# EAGLE design ZeroUNOBridge (EAGLE 6.6.0)
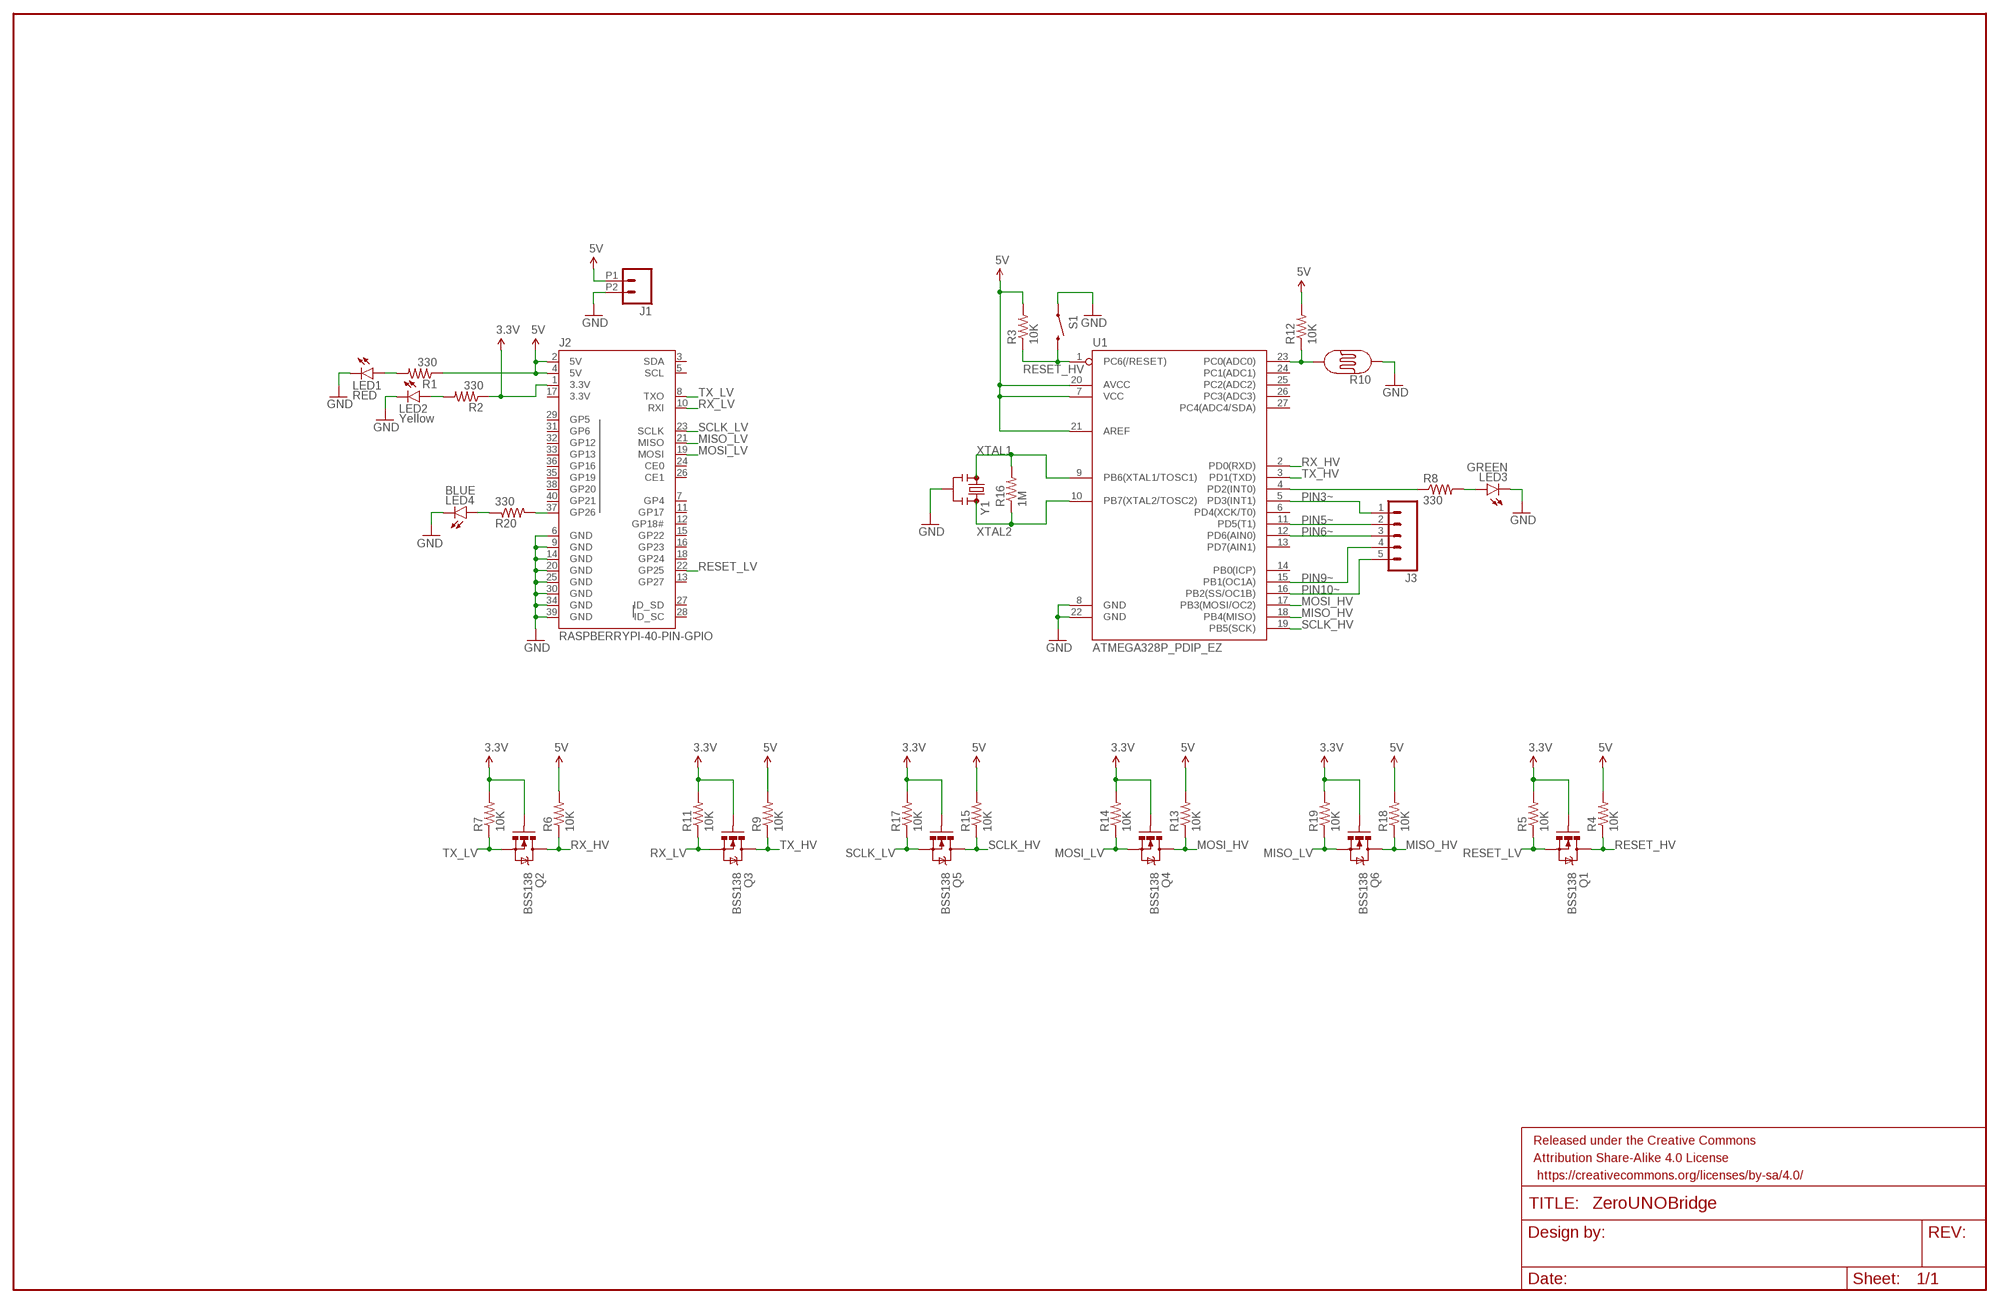
[diagram p0: schematic, sheet 1]

## Parts
FRAME1  FRAME-LEDGER  [CREATIVE_COMMONS]
J1  M022.54MM_SCREWTERM  [1X02_2.54_SCREWTERM]
J2  RASPBERRYPI-40-PIN-GPIO  [2X20-SHROUDED]
J3  M05SCREW  [SCREWTERMINAL-3.5MM-5]
LED1  RED  LED-RED0603  [LED-0603]
LED2  Yellow  LED-YELLOW0603  [LED-0603]
LED3  GREEN  LED-GREEN0603  [LED-0603]
LED4  BLUE  LED-BLUE0603  [LED-0603]
Q1  BSS138  MOSFET-NCHANNELBSS138  [SOT23-3]
Q2  BSS138  MOSFET-NCHANNELBSS138  [SOT23-3]
Q3  BSS138  MOSFET-NCHANNELBSS138  [SOT23-3]
Q4  BSS138  MOSFET-NCHANNELBSS138  [SOT23-3]
Q5  BSS138  MOSFET-NCHANNELBSS138  [SOT23-3]
Q6  BSS138  MOSFET-NCHANNELBSS138  [SOT23-3]
R1  330  330OHM1/10W1%(0603)  [0603-RES]
R2  330  330OHM1/10W1%(0603)  [0603-RES]
R3  10K  10KOHM-1/10W-1%(0603)0603  [0603-RES]
R4  10K  10KOHM-1/10W-1%(0603)0603  [0603-RES]
R5  10K  10KOHM-1/10W-1%(0603)0603  [0603-RES]
R6  10K  10KOHM-1/10W-1%(0603)0603  [0603-RES]
R7  10K  10KOHM-1/10W-1%(0603)0603  [0603-RES]
R8  330  330OHM1/10W1%(0603)  [0603-RES]
R9  10K  10KOHM-1/10W-1%(0603)0603  [0603-RES]
R10  PHOTOCELLPTH  [PHOTOCELL]
R11  10K  10KOHM-1/10W-1%(0603)0603  [0603-RES]
R12  10K  10KOHM-1/10W-1%(0603)0603  [0603-RES]
R13  10K  10KOHM-1/10W-1%(0603)0603  [0603-RES]
R14  10K  10KOHM-1/10W-1%(0603)0603  [0603-RES]
R15  10K  10KOHM-1/10W-1%(0603)0603  [0603-RES]
R16  1M  1MOHM-1/10W-1%(0603)  [0603-RES]
R17  10K  10KOHM-1/10W-1%(0603)0603  [0603-RES]
R18  10K  10KOHM-1/10W-1%(0603)0603  [0603-RES]
R19  10K  10KOHM-1/10W-1%(0603)0603  [0603-RES]
R20  330  330OHM1/10W1%(0603)  [0603-RES]
S1  SWITCH-MOMENTARY-2PTH  [TACTILE-PTH]
U1  ATMEGA328P_PDIP_EZ  [DIL28-EZ]
Y1  RESONATORPTH  [RESONATOR-PTH]

## Nets
3.3V: J2.1(3.3V) Q1.1(G) Q2.1(G) Q3.1(G) Q4.1(G) Q5.1(G) Q6.1(G) R2.1 R5.2 R7.2 R11.2 R14.2 R17.2 R19.2
5V: J1.P1 J2.2(5V) J2.4(5V) R1.1 R3.2 R4.2 R6.2 R9.2 R12.2 R13.2 R15.2 R18.2 U1.7(VCC) U1.20(AVCC) U1.21(AREF)
GND: J1.P2 J2.6(GND) J2.9(GND) J2.14(GND) J2.20(GND) J2.25(GND) J2.30(GND) J2.34(GND) J2.39(GND) LED1.C LED2.C LED3.C LED4.C R10.1 S1.1 U1.8(GND) U1.22(GND) Y1.2
MISO_HV: Q6.3(D) R18.1 U1.18(PB4(MISO))
MISO_LV: J2.21(MISO) Q6.2(S) R19.1
MOSI_HV: Q4.3(D) R13.1 U1.17(PB3(MOSI/OC2))
MOSI_LV: J2.19(MOSI) Q4.2(S) R14.1
N$1: J2.37(GP26) R20.2
N$3: LED1.A R1.2
N$4: LED2.A R2.2
N$5: LED4.A R20.1
N$6: R8.1 U1.4(PD2(INT0))
N$7: LED3.A R8.2
N$9: R10.2 R12.1 U1.23(PC0(ADC0))
PIN3~: J3.1 U1.5(PD3(INT1))
PIN5~: J3.2 U1.11(PD5(T1))
PIN6~: J3.3 U1.12(PD6(AIN0))
PIN9~: J3.4 U1.15(PB1(OC1A))
PIN10~: J3.5 U1.16(PB2(SS/OC1B))
RESET_HV: Q1.3(D) R3.1 R4.1 S1.3 U1.1(PC6(/RESET))
RESET_LV: J2.22(GP25) Q1.2(S) R5.1
RX_HV: Q2.3(D) R6.1 U1.2(PD0(RXD))
RX_LV: J2.10(RXI) Q3.2(S) R11.1
SCLK_HV: Q5.3(D) R15.1 U1.19(PB5(SCK))
SCLK_LV: J2.23(SCLK) Q5.2(S) R17.1
TX_HV: Q3.3(D) R9.1 U1.3(PD1(TXD))
TX_LV: J2.8(TXO) Q2.2(S) R7.1
XTAL1: R16.2 U1.9(PB6(XTAL1/TOSC1)) Y1.1
XTAL2: R16.1 U1.10(PB7(XTAL2/TOSC2)) Y1.3
Unconnected: J2.3(SDA) J2.5(SCL) J2.7(GP4) J2.11(GP17) J2.12(GP18#) J2.13(GP27) J2.15(GP22) J2.16(GP23) J2.18(GP24) J2.24(CE0) J2.26(CE1) J2.27(ID_SD) J2.28(ID_SC) J2.29(GP5) J2.31(GP6) J2.32(GP12) J2.33(GP13) J2.35(GP19) J2.36(GP16) J2.38(GP20) J2.40(GP21) U1.6(PD4(XCK/T0)) U1.13(PD7(AIN1)) U1.14(PB0(ICP)) U1.24(PC1(ADC1)) U1.25(PC2(ADC2)) U1.26(PC3(ADC3)) U1.27(PC4(ADC4/SDA))

## Power pins joined to a net without a drawn wire
3.3V: J2.17(3.3V)

## Library data of the parts
FRAME1 = SparkFun-Aesthetics:FRAME-LEDGER: Schematic Frame Standard 11x14 US Ledger frame
J1 = SparkFun-Connectors:M02: Standard 2-pin 0.1" header. Use with - straight break away headers ( PRT-00116) - right angle break away headers (PRT-00553) - swiss pins (PRT-00743) - machine pins (PRT-00117) - female headers (PRT-00115) Molex polarized connector foot print use with: PRT-08233 with associated crimp pins and housings. 2.54_SCREWTERM for use with PRT-10571. 3.5mm Screw Terminal footprints for PRT-08084 5mm Screw Terminal footprints for use with PRT-08432
J2 = SparkFun-Boards:RASPBERRYPI-40-PIN-GPIO: Second Generation Raspberry Pi GPIO Header 2x20 pin connector, as found on B, B+, A+ models.
J3 = SparkFun-Connectors:M05: Header 5 Standard 5-pin 0.1" header. Use with straight break away headers (SKU : PRT-00116), right angle break away headers (PRT-00553), swiss pins (PRT-00743), machine pins (PRT-00117), and female headers (PRT-00115). Molex polarized connector foot print use with SKU : PRT-08230 with associated crimp pins and housings.; PROD_ID: Combine 8288+8399
LED1 = SparkFun-LED:LED-RED: Assorted Red LEDs LilyPad 1206- DIO-09912 1206- DIO-00809 0603- DIO-00819 "SMART" means more efficient and expensive; PROD_ID: DIO-00819
LED2 = SparkFun-LED:LED-YELLOW: Yellow SMD LEDs LilyPad 1206- DIO-09909 0603- DIO-09003 "SMART" means more efficient and expensive; PROD_ID: DIO-09003
LED3 = SparkFun-LED:LED-GREEN: Various green LEDs Green LEDs used in SFE Production 0603- DIO-00821 LARGE- DIO-00862 LILYPAD- DIO-09910; PROD_ID: DIO-00821
LED4 = SparkFun-LED:LED-BLUE: Blue LEDs for production use Various blue LEDs stocked by SparkFun production 0603 - DIO-08575 Rebel - DIO-09553 1206 - DIO-09911; PROD_ID: DIO-08575
Q1-Q6 = SparkFun-DiscreteSemi:MOSFET-NCHANNEL: Common NMOSFET Parts MFG P/N Store ID Prod ID FDD8780 TRANS-09984 SI7820DN TRANS-11055 FDS6630A IC-08089 2N7002PW TRANS-11151 FQP30N06L COM-10213 TRANS-10060 BSS123LT1G TRANS-08345 BSS138 TRANS-00830 BS170 2N7000; PROD_ID: TRANS-00830; VALUE: 200mA/50V
R1 R2 R8 R20 = SparkFun-Resistors:330OHM1/10W1%(0603): RES-00818; PROD_ID: RES-00818
R3-R7 R9 R11-R15 R17-R19 = SparkFun-Resistors:10KOHM-1/10W-1%(0603): RES-00824; PROD_ID: RES-00824
R10 = SparkFun-Sensors:PHOTOCELL: CdS photoresistor. This is a low cost way to detect light levels. Resistance decreases with more incoming light. SparkFun SKU: SEN-09088
R16 = SparkFun-Resistors:1MOHM-1/10W-1%(0603): RES-07868; PROD_ID: RES-07868
S1 = SparkFun-Electromechanical:SWITCH-MOMENTARY-2: Various NO switches- pushbuttons, reed, etc; PROD_ID: SWCH-08441
U1 = SparkFun-DigitalIC:ATMEGA328P_PDIP_EZ: uC used in the Arduino 32kb flash, 1k EEPROM, 2k SRAM This is the through-hole version of this chip.
Y1 = SparkFun-FreqCtrl:RESONATOR: Resonator Small SMD resonator. Used, eg, on the Arduino Pro/ Pro Mini boards. 8MHz- XTAL-08895 16MHz- XTAL-08900

## Board
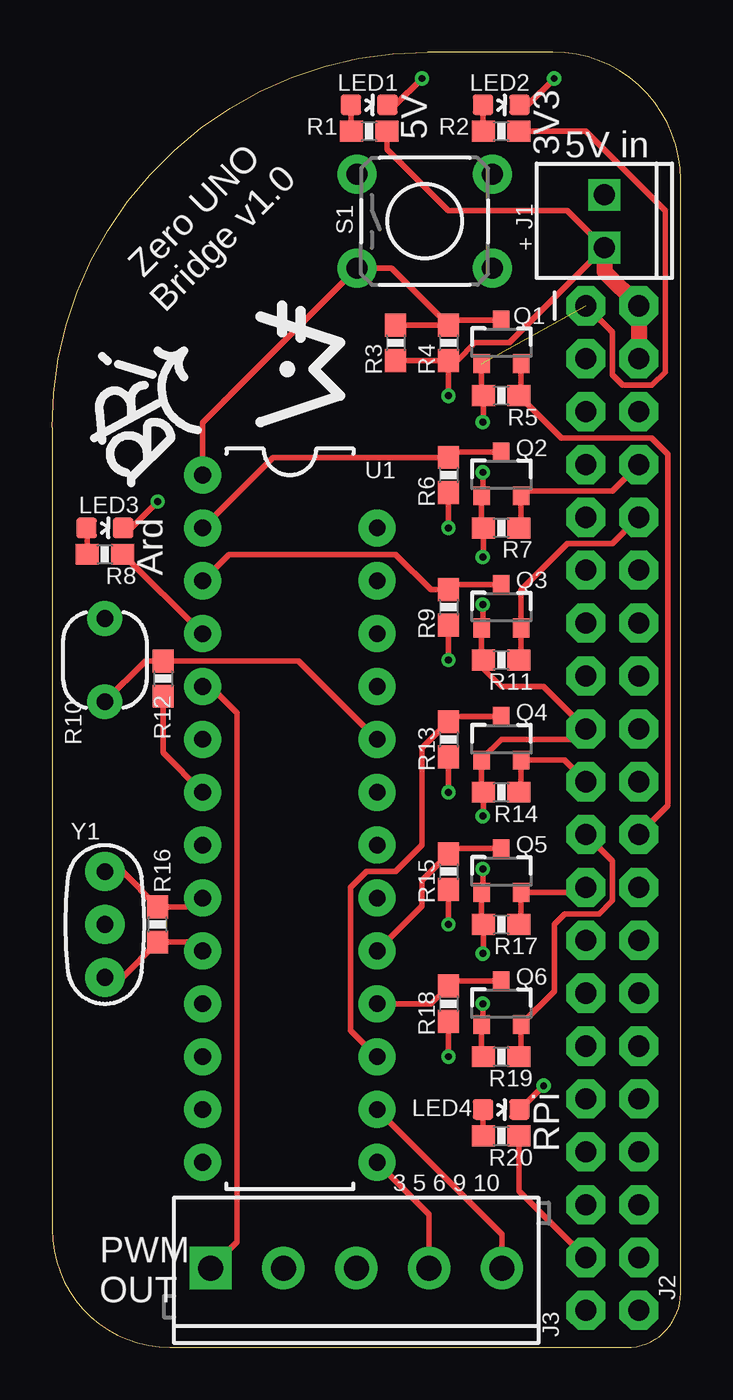
[diagram p1: board, top side]
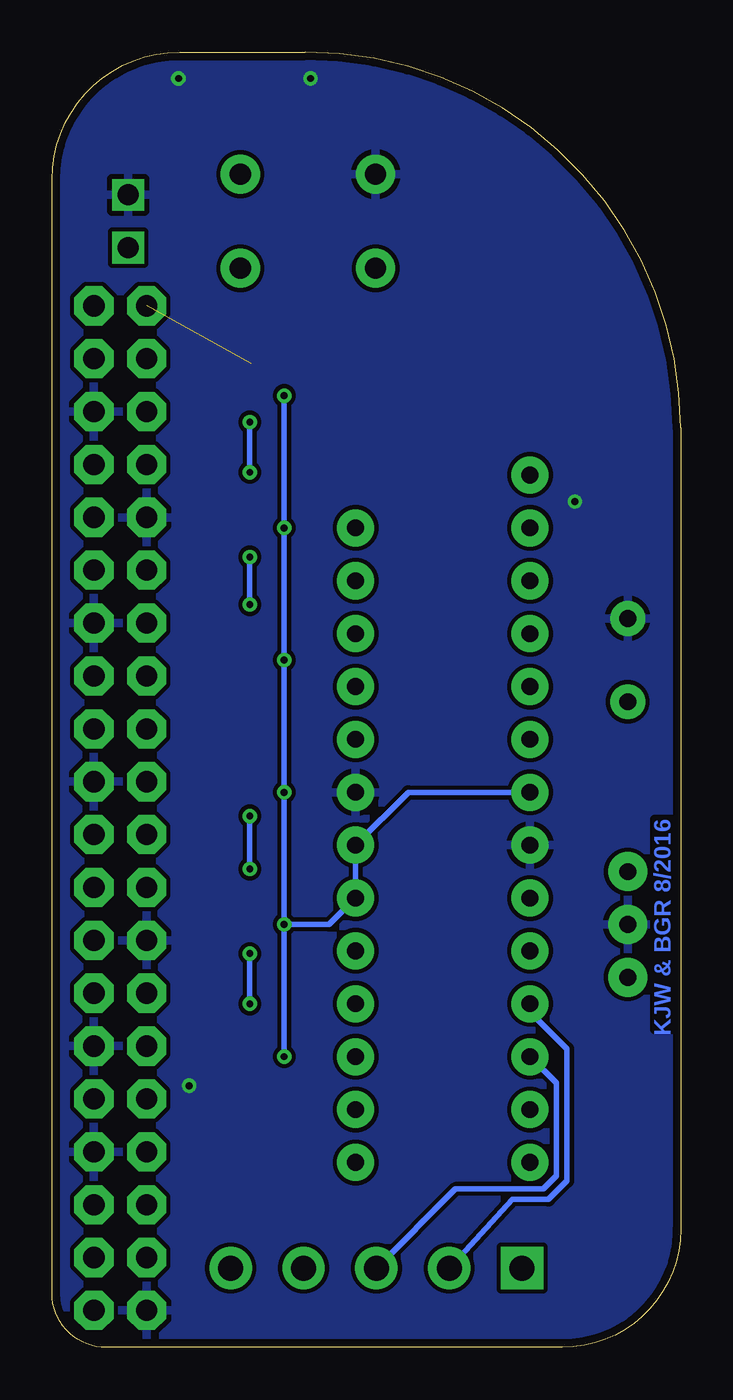
[diagram p2: board, bottom side, seen from below]

Size 30.21 x 62.23 mm. Coordinates in mm from the lower left corner, seen from the top.
Outline: 0,44.18 0,5.68 arc90 5.68,0 27.61,0 arc90 30.21,2.6 30.21,56.1 arc90 24.07,62.23 18.05,62.23 arc90 0,44.18
Copper layers (1*16): Top 0.0356mm / dielectric 1.5011mm / Bottom 0.0356mm
Design rules "LaenPCBOrder *": minimum track width 6mil, minimum drill 13mil, track to track 8mil, track to pad 8mil, pad to pad 8mil, via to via 8mil, smd to smd 6mil, copper to edge 15mil, drill to drill 6mil, minimum pad ring 7mil, minimum via ring 7mil, stop-mask expansion 3mil, vias tented up to drill 0mil, thermal gap 10mil

### Footprints (pad centres in the part's own frame; a part is rotated, then mirrored left to right if it is on the bottom)
1X02_2.54_SCREWTERM = drill 1.016 square: P1 2.54,0; P2 0,0
2X20-SHROUDED = drill 1.016 pad 1.88 octagon: 1 -1.27,24.13; 2 1.27,24.13; 3 -1.27,21.59; 4 1.27,21.59; 5 -1.27,19.05; 6 1.27,19.05; 7 -1.27,16.51; 8 1.27,16.51; 9 -1.27,13.97; 10 1.27,13.97; 11 -1.27,11.43; 12 1.27,11.43; 13 -1.27,8.89; 14 1.27,8.89; 15 -1.27,6.35; 16 1.27,6.35; 17 -1.27,3.81; 18 1.27,3.81; 19 -1.27,1.27; 20 1.27,1.27; 21 -1.27,-1.27; 22 1.27,-1.27; 23 -1.27,-3.81; 24 1.27,-3.81; 25 -1.27,-6.35; 26 1.27,-6.35; 27 -1.27,-8.89; 28 1.27,-8.89; 29 -1.27,-11.43; 30 1.27,-11.43; 31 -1.27,-13.97; 32 1.27,-13.97; 33 -1.27,-16.51; 34 1.27,-16.51; 35 -1.27,-19.05; 36 1.27,-19.05; 37 -1.27,-21.59; 38 1.27,-21.59; 39 -1.27,-24.13; 40 1.27,-24.13
SCREWTERMINAL-3.5MM-5 = drill 1.2 pad 2.032 square: 1 0,0 | drill 1.2 pad 2.032: 2 3.5,0; 3 7,0; 4 10.5,0; 5 14,0
LED-0603 = smd 1 x 1: A 0,-0.877; C 0,0.877
SOT23-3 = smd 0.8 x 0.9: 1 -0.95,-1; 2 0.95,-1; 3 0,1.1
0603-RES = smd 1.1 x 1: 1 -0.85,0; 2 0.85,0
PHOTOCELL = drill 0.8 pad 1.676: 1 -2,0; 2 2,0
TACTILE-PTH = drill 1.016 pad 1.88: 1 -3.251,2.261; 2 3.251,2.261; 3 -3.251,-2.261; 4 3.251,-2.261
DIL28-EZ = drill 0.8 pad 1.778: 1 -16.51,-4.191; 2 -13.97,-4.191; 3 -11.43,-4.191; 4 -8.89,-4.191; 5 -6.35,-4.191; 6 -3.81,-4.191; 7 -1.27,-4.191; 8 1.27,-4.191; 9 3.81,-4.191; 10 6.35,-4.191; 11 8.89,-4.191; 12 11.43,-4.191; 13 13.97,-4.191; 14 16.51,-4.191; 15 16.51,4.191; 16 13.97,4.191; 17 11.43,4.191; 18 8.89,4.191; 19 6.35,4.191; 20 3.81,4.191; 21 1.27,4.191; 22 -1.27,4.191; 23 -3.81,4.191; 24 -6.35,4.191; 25 -8.89,4.191; 26 -11.43,4.191; 27 -13.97,4.191
RESONATOR-PTH = drill 0.8 pad 1.88: 1 -2.54,0; 2 0,0; 3 2.54,0

### Placement (x,y rotation side)
FRAME1  -1.27,-54.61 0 top  (outside the outline)
J1  26.54,55.37 270 top
J2  26.92,25.91 0 top
J3  7.62,3.81 0 top
LED1  15.24,59.69 270 top
LED2  21.59,59.69 270 top
LED3  2.54,39.37 270 top
LED4  21.59,11.43 270 top
Q1  21.59,48.26 0 top
Q2  21.59,41.91 0 top
Q3  21.59,35.56 0 top
Q4  21.59,29.21 0 top
Q5  21.59,22.86 0 top
Q6  21.59,16.51 0 top
R1  15.24,58.42 180 top
R2  21.59,58.42 180 top
R3  16.51,48.26 270 top
R4  19.05,48.26 270 top
R5  21.59,45.72 180 top
R6  19.05,41.91 270 top
R7  21.59,39.37 180 top
R8  2.54,38.1 180 top
R9  19.05,35.56 270 top
R10  2.54,33.02 270 top
R11  21.59,33.02 180 top
R12  5.33,32.13 270 top
R13  19.05,29.21 270 top
R14  21.59,26.67 180 top
R15  19.05,22.86 270 top
R16  5.08,20.32 90 top
R17  21.59,20.32 180 top
R18  19.05,16.51 270 top
R19  21.59,13.97 180 top
R20  21.59,10.16 0 top
S1  17.91,54.1 0 top
U1  11.43,25.4 270 top
Y1  2.54,20.32 270 top

### Tracks (layer width: path | path; a pad name or v marks a point on that pad's centre or on a via)
3.3V  (via drill 0.33)  (1 unrouted)
  Top 0.254: J2.1 26.92,48.77 26.92,46.74 27.43,46.23 28.83,46.23 29.46,46.86 29.46,54.61 25.65,58.42 R2.1 | R19.2 20.64,14.07 Q6.1 20.7,15.57 v20.7,16.51 | Q1.1 20.64,45.82 R5.2 20.74,44.49 v20.7,44.45 | v20.7,37.97 20.74,38.01 R7.2 20.64,39.47 Q2.1 20.7,40.97 v20.7,42.04 | v20.7,35.69 20.7,34.62 Q3.1 20.64,33.12 R11.2 20.74,32.6 21.59,31.75 23.62,31.75 J2.17 25.15,29.21 21.59,29.21 20.64,28.26 Q4.1 20.64,26.77 R14.2 20.74,25.57 v20.7,25.53 | v20.7,22.99 20.7,21.92 Q5.1 20.64,20.42 R17.2 20.74,18.96 v20.7,18.92
  Bottom 0.254: v20.7,37.97 v20.7,35.69 | v20.7,44.45 v20.7,42.04 | v20.7,25.53 v20.7,22.99 | v20.7,18.92 v20.7,16.51
5V  (via drill 0.33)
  Top 0.254: v19.05,45.72 R4.2 | R4.2 R3.2 | v19.05,39.37 R6.2 | v19.05,33.02 R9.2 | v19.05,26.67 R13.2 | v19.05,20.32 R15.2 | v19.05,13.97 R18.2 | R4.2 19.47,47.41 20.32,48.26 21.97,48.26 J1.P1 24.77,54.61 19.05,54.61 16.09,57.57 R1.1 | R12.2 5.33,28.57 U1.7
  Top 0.762: J1.P1 26.54,51.69 J2.2 J2.4
  Bottom 0.254: v19.05,45.72 v19.05,39.37 v19.05,33.02 v19.05,26.67 v19.05,20.32 | v19.05,20.32 v19.05,13.97 | v19.05,20.32 16.89,20.32 U1.20 U1.21 13.08,26.67 U1.7
GND  (via drill 0.33)
  Top 0.254: LED3.C 3.81,39.37 v5.08,40.64 | LED1.C 16.51,59.69 v17.78,60.96 | LED4.C v23.62,12.57 | LED2.C 22.86,59.69 v24.13,60.96
  pour Bottom: -0.64,60.96 -0.64,5.08 arc90 5.08,0 30.48,0 30.48,62.74 arc90 30.1,63.12 -0.38,63.12 arc90
MISO_HV
  Top 0.254: Q6.3 19.3,17.61 R18.1 18.2,16.51 U1.18
MISO_LV
  Top 0.254: R19.1 22.54,14.07 Q6.2 24.13,17.1 24.13,20.32 24.64,20.83 26.29,20.83 26.92,21.46 26.92,23.37 J2.21
MOSI_HV
  Top 0.254: Q4.3 19.3,30.31 R13.1 17.78,28.79 17.78,24.13 16.51,22.86 15.11,22.86 14.35,22.1 14.35,15.24 U1.17
MOSI_LV
  Top 0.254: R14.1 22.54,26.77 Q4.2 24.62,28.21 J2.19
N$1
  Top 0.254: R20.2 22.44,7.53 J2.37
N$3
  Top 0.254: LED1.A 14.36,58.45 R1.2
N$4
  Top 0.254: LED2.A 20.71,58.45 R2.2
N$5
  Top 0.254: LED4.A 20.71,10.19 R20.1
N$6
  Top 0.254: R8.1 3.43,38.1 U1.4
N$7
  Top 0.254: R8.2 1.69,39.34 LED3.A
N$9
  Top 0.254: U1.23 11.85,32.98 R12.1 4.5,32.98 R10.2
PIN3~
  Top 0.254: U1.5 7.62,31.75 8.89,30.48 8.89,5.08 J3.1
PIN5~
  Bottom 0.254: U1.11 7.24,16.13 5.46,14.35 5.46,8 6.35,7.11 8.07,7.11 J3.2
PIN6~
  Bottom 0.254: U1.12 5.97,12.7 5.97,8.26 6.6,7.62 10.81,7.62 J3.3
PIN9~
  Top 0.254: U1.15 18.12,6.39 J3.4
PIN10~
  Top 0.254: U1.16 21.62,5.43 J3.5
RESET_HV
  Top 0.254: R4.1 19.3,49.36 Q1.3 | R4.1 16.32,51.84 S1.3 7.24,44.42 U1.1 | R3.1 R4.1
RESET_LV
  Top 0.254: Q1.2 22.54,45.82 R5.1 24.47,43.69 28.83,43.69 29.59,42.93 29.59,26.04 J2.22
RX_HV
  Top 0.254: Q2.3 19.3,43.01 R6.1 10.63,42.76 U1.2
RX_LV
  Top 0.254: R11.1 22.54,33.12 Q3.2 22.54,36.38 24.77,38.61 26.92,38.61 J2.10
SCLK_HV
  Top 0.254: Q5.3 19.3,23.96 R15.1 17.78,22.44 17.78,21.21 U1.19
SCLK_LV
  Top 0.254: R17.1 22.54,20.42 Q5.2 25.42,21.86 J2.23
TX_HV
  Top 0.254: Q3.3 19.3,36.66 R9.1 18.2,36.41 16.51,38.1 8.51,38.1 U1.3
TX_LV
  Top 0.254: R7.1 22.54,39.47 Q2.2 22.78,41.15 26.92,41.15 J2.8
XTAL1
  Top 0.254: U1.9 6.82,21.17 R16.2 3.39,22.86 Y1.1
XTAL2
  Top 0.254: U1.10 6.82,19.47 R16.1 3.39,17.78 Y1.3

### Text on the board
Bottom: KJW & BGR 8/2016
tNames: 5V | 3V3 | 5V in | Zero UNO / Bridge v1.0 | J1 | + | Ard | Y1 | RPi | 3 5 6 9 10 | PWM / OUT